# EAGLE design carteUC_V3 (EAGLE 7.5.0)
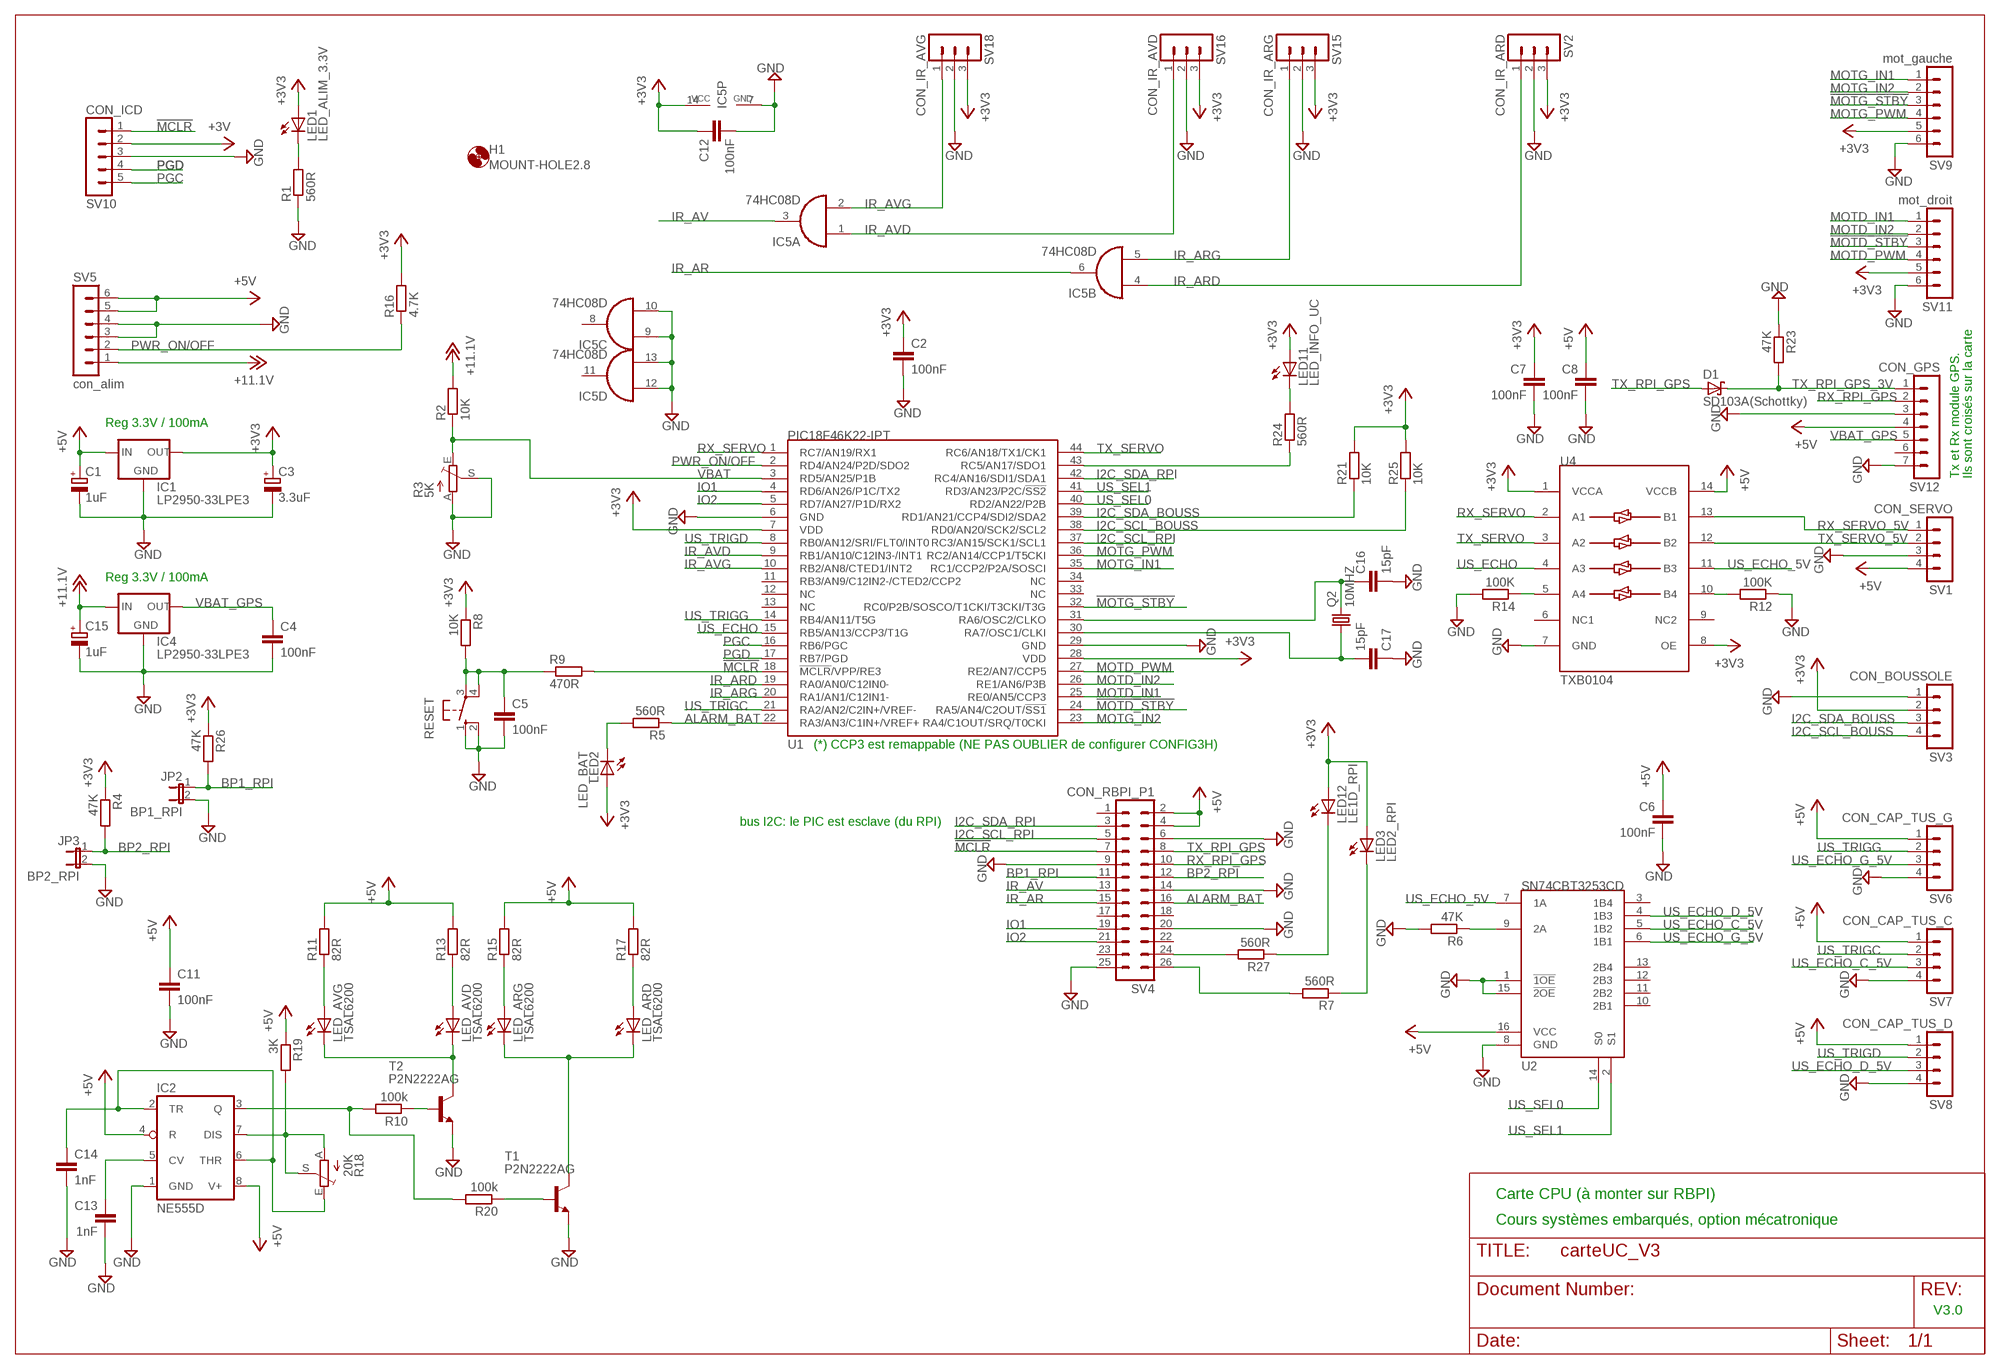
[diagram p0: schematic, sheet 1]

## Parts
C1  1uF  CPOL-EUE2.5-5  [E2,5-5]
C2  100nF  C-EUC1206  [C1206]
C3  3.3uF  CPOL-EUE2.5-5  [E2,5-5]
C4  100nF  C-EUC1206  [C1206]
C5  100nF  C-EUC1206  [C1206]
C6  100nF  C-EUC1206  [C1206]
C7  100nF  C-EUC1206  [C1206]
C8  100nF  C-EUC1206  [C1206]
C11  100nF  C-EUC1206  [C1206]
C12  100nF  C-EUC1206  [C1206]
C13  1nF  C-EU025-024X044  [C025-024X044]
C14  1nF  C-EU025-024X044  [C025-024X044]
C15  1uF  CPOL-EUE2.5-5  [E2,5-5]
C16  15pF  C5/2.5  [C5B2.5]
C17  15pF  C5/2.5  [C5B2.5]
D1  SD103A(Schottky)  SCHOTTKY-DIODEDO35-7  [DO35-7]
H1  MOUNT-HOLE2.8  [2,8]
IC1  LP2950-33LPE3  78LXX  [78LXX]
IC2  NE555D  [SO08]
IC4  LP2950-33LPE3  78LXX  [78LXX]
IC5  74HC08D  [SO14]
JP2  BP1_RPI  JP1E  [JP1]
JP3  BP2_RPI  JP1E  [JP1]
LED1  LED_ALIM_3.3V  LED3MM  [LED3MM]
LED2  LED_BAT  LED3MM  [LED3MM]
LED3  LED2_RPI  LED3MM  [LED3MM]
LED11  LED_INFO_UC  LED3MM  [LED3MM]
LED12  LE1D_RPI  LED3MM  [LED3MM]
LED_ARD  TSAL6200  LED5MM  [LED5MM]
LED_ARG  TSAL6200  LED5MM  [LED5MM]
LED_AVD  TSAL6200  LED5MM  [LED5MM]
LED_AVG  TSAL6200  LED5MM  [LED5MM]
Q2  10MHZ  CRYSTALHC49U70  [HC49U70]
R1  560R  R-EU_R1206  [R1206]
R2  10K  R-EU_R1206  [R1206]
R3  5K  TRIM_EU-S63S  [S63S]
R4  47K  R-EU_R1206  [R1206]
R5  560R  R-EU_R1206  [R1206]
R6  47K  R-EU_R1206  [R1206]
R7  560R  R-EU_R1206  [R1206]
R8  10K  R-EU_R1206  [R1206]
R9  470R  R-EU_R1206  [R1206]
R10  100k  R-EU_0207/10  [0207/10]
R11  82R  R-EU_0207/10  [0207/10]
R12  100K  R-EU_R1206  [R1206]
R13  82R  R-EU_0207/10  [0207/10]
R14  100K  R-EU_R1206  [R1206]
R15  82R  R-EU_0207/10  [0207/10]
R16  4.7K  R-EU_R1206  [R1206]
R17  82R  R-EU_0207/10  [0207/10]
R18  20K  TRIM_EU-S63P  [S63P]
R19  3K  R-EU_0207/10  [0207/10]
R20  100k  R-EU_0207/10  [0207/10]
R21  10K  R-EU_R1206  [R1206]
R23  47K  R-EU_R1206  [R1206]
R24  560R  R-EU_R1206  [R1206]
R25  10K  R-EU_R1206  [R1206]
R26  47K  R-EU_R1206  [R1206]
R27  560R  R-EU_R1206  [R1206]
RESET  10-XX  [B3F-10XX]
SV1  CON_SERVO  MA04-1  [MA04-1]
SV2  CON_IR_ARD  MA03-1  [MA03-1]
SV3  CON_BOUSSOLE  MA04-1  [MA04-1]
SV4  CON_RBPI_P1  MA13-2  [MA13-2]
SV5  con_alim  MA06-1  [MA06-1]
SV6  CON_CAP_TUS_G  MA04-1  [MA04-1]
SV7  CON_CAP_TUS_C  MA04-1  [MA04-1]
SV8  CON_CAP_TUS_D  MA04-1  [MA04-1]
SV9  mot_gauche  MA06-1  [MA06-1]
SV10  CON_ICD  MA05-1  [MA05-1]
SV11  mot_droit  MA06-1  [MA06-1]
SV12  CON_GPS  MA07-1  [MA07-1]
SV15  CON_IR_ARG  MA03-1  [MA03-1]
SV16  CON_IR_AVD  MA03-1  [MA03-1]
SV18  CON_IR_AVG  MA03-1  [MA03-1]
T1  P2N2222AG  2N2222-NPN-TO92-EBC  [TO92-EBC]
T2  P2N2222AG  2N2222-NPN-TO92-EBC  [TO92-EBC]
U1  PIC18F46K22-IPT  [TQFP44]
U2  SN74CBT3253CD  [SOIC16]
U4  TXB0104  [PSOP14]

## Nets
!MCLR!: R9.2 SV4.7 SV10.1 U1.18(!MCLR!/VPP/RE3)
!MOTD_STBY!: SV11.3 U1.24(RA5/AN4/C2OUT/!SS1)
!MOTG_STBY!: SV9.3 U1.32(RC0/P2B/SOSCO/T1CKI/T3CKI/T3G)
+3V3: C2.1 C3.+ C7.1 C12.1 IC1.OUT IC5.14(P:VCC) LED1.A LED2.A LED3.A LED11.A LED12.A R4.1 R8.1 R16.2 R21.2 R25.2 R26.1 SV2.3 SV3.2 SV9.5 SV10.2 SV11.5 SV15.3 SV16.3 SV18.3 U1.7(VDD) U1.28(VDD) U4.1(VCCA) U4.8(OE) ; supply symbol labelled +3V
+5V: C1.+ C6.1 C8.1 C11.1 IC1.IN IC2.4(R) IC2.8(V+) R11.2 R13.2 R15.2 R17.2 R19.1 SV1.4 SV4.2 SV4.4 SV5.5 SV5.6 SV6.1 SV7.1 SV8.1 SV12.4 U2.16(VCC) U4.14(VCCB)
+12V: C15.+ IC4.IN R2.2 SV5.1 ; supply symbol labelled +11.1V
ALARM_BAT: R5.1 SV4.16 U1.22(RA3/AN3/C1IN+/VREF+)
BP1_RPI: JP2.1 R26.2 SV4.11
BP2_RPI: JP3.1 R4.2 SV4.12
GND: C1.- C2.2 C3.- C4.2 C5.2 C6.2 C7.2 C8.2 C11.2 C12.2 C13.2 C14.2 C15.- C16.2 C17.1 IC1.GND IC2.1(GND) IC4.GND IC5.7(P:GND) IC5.9(C:I0) IC5.10(C:I1) IC5.12(D:I0) IC5.13(D:I1) JP2.2 JP3.2 R1.1 R3.A R3.S R6.2 R12.1 R14.2 R23.1 RESET.1(S) RESET.2(S1) SV1.3 SV2.2 SV3.1 SV4.6 SV4.9 SV4.14 SV4.20 SV4.25 SV5.3 SV5.4 SV6.4 SV7.4 SV8.4 SV9.6 SV10.3 SV11.6 SV12.3 SV12.7 SV15.2 SV16.2 SV18.2 T1.C(E) T2.C(E) U1.6(GND) U1.29(GND) U2.1(!1OE) U2.8(GND) U2.15(!2OE) U4.7(GND)
I2C_SCL_BOUSS: R25.1 SV3.4 U1.38(RD0/AN20/SCK2/SCL2)
I2C_SCL_RPI: SV4.5 U1.37(RC3/AN15/SCK1/SCL1)
I2C_SDA_BOUSS: R21.1 SV3.3 U1.39(RD1/AN21/CCP4/SDI2/SDA2)
I2C_SDA_RPI: SV4.3 U1.42(RC4/AN16/SDI1/SDA1)
IO1: SV4.19 U1.4(RD6/AN26/P1C/TX2)
IO2: SV4.21 U1.5(RD7/AN27/P1D/RX2)
IR_AR: IC5.6(B:O) SV4.15
IR_ARD: IC5.4(B:I0) SV2.1 U1.19(RA0/AN0/C12IN0-)
IR_ARG: IC5.5(B:I1) SV15.1 U1.20(RA1/AN1/C12IN1-)
IR_AV: IC5.3(A:O) SV4.13
IR_AVD: IC5.1(A:I0) SV16.1 U1.9(RB1/AN10/C12IN3-/INT1)
IR_AVG: IC5.2(A:I1) SV18.1 U1.10(RB2/AN8/CTED1/INT2)
MOTD_IN1: SV11.1 U1.25(RE0/AN5/CCP3)
MOTD_IN2: SV11.2 U1.26(RE1/AN6/P3B)
MOTD_PWM: SV11.4 U1.27(RE2/AN7/CCP5)
MOTG_IN1: SV9.1 U1.35(RC1/CCP2/P2A/SOSCI)
MOTG_IN2: SV9.2 U1.23(RA4/C1OUT/SRQ/T0CKI)
MOTG_PWM: SV9.4 U1.36(RC2/AN14/CCP1/T5CKI)
N$1: LED1.K(C) R1.2
N$2: R24.1 U1.43(RC5/AN17/SDO1)
N$3: LED2.K(C) R5.2
N$4: LED11.K(C) R24.2
N$5: C5.1 R8.2 R9.1 RESET.3(P) RESET.4(P1)
N$6: LED3.K(C) R7.1
N$7: R10.1 T2.B
N$8: LED_AVG.A R11.1
N$10: LED_AVD.A R13.1
N$11: LED_AVD.K(C) LED_AVG.K(C) T2.E(C)
N$12: R20.1 T1.B
N$13: C13.1 IC2.5(CV)
N$14: LED_ARG.A R15.1
N$15: R14.1 U4.5(A4)
N$16: LED_ARD.A R17.1
N$17: LED_ARD.K(C) LED_ARG.K(C) T1.E(C)
N$18: IC2.7(DIS) R18.A R18.S R19.2
N$19: IC2.3(Q) R10.2 R20.2
N$20: LED12.K(C) R27.1
N$21: C14.1 IC2.2(TR) IC2.6(THR) R18.E
N$22: R7.2 SV4.26
N$23: R12.2 U4.10(B4)
N$26: R6.1 U2.9(2A)
N$28: C16.1 Q2.2 U1.31(RA6/OSC2/CLKO)
N$29: C17.2 Q2.1 U1.30(RA7/OSC1/CLKI)
PGC: SV10.5 U1.16(RB6/PGC)
PGD: SV10.4 U1.17(RB7/PGD)
PWR_ON/OFF: R16.1 SV5.2 U1.2(RD4/AN24/P2D/SDO2)
RPI_LED: R27.2 SV4.24
RX_RPI_GPS: SV4.10 SV12.2
RX_SERVO: U1.1(RC7/AN19/RX1) U4.2(A1)
RX_SERVO_5V: SV1.1 U4.13(B1)
TX_RPI_GPS: D1.A SV4.8
TX_RPI_GPS_3V: D1.C R23.2 SV12.1
TX_SERVO: U1.44(RC6/AN18/TX1/CK1) U4.3(A2)
TX_SERVO_5V: SV1.2 U4.12(B2)
US_ECHO: U1.15(RB5/AN13/CCP3/T1G) U4.4(A3)
US_ECHO_5V: U2.7(1A) U4.11(B3)
US_ECHO_C_5V: SV7.3 U2.5(1B2)
US_ECHO_D_5V: SV8.3 U2.4(1B3)
US_ECHO_G_5V: SV6.3 U2.6(1B1)
US_SEL0: U1.40(RD2/AN22/P2B) U2.14(S0)
US_SEL1: U1.41(RD3/AN23/P2C/!SS2) U2.2(S1)
US_TRIGC: SV7.2 U1.21(RA2/AN2/C2IN+/VREF-)
US_TRIGD: SV8.2 U1.8(RB0/AN12/SRI/FLT0/INT0)
US_TRIGG: SV6.2 U1.14(RB4/AN11/T5G)
VBAT: R2.1 R3.E U1.3(RD5/AN25/P1B)
VBAT_GPS: C4.1 IC4.OUT SV12.5
Unconnected: IC5.8(C:O) IC5.11(D:O) SV4.1 SV4.17 SV4.18 SV4.22 SV4.23 SV12.6 U1.11(RB3/AN9/C12IN2-/CTED2/CCP2) U1.12(NC) U1.13(NC) U1.33(NC) U1.34(NC) U2.3(1B4) U2.10(2B1) U2.11(2B2) U2.12(2B3) U2.13(2B4) U4.6(NC1) U4.9(NC2)

## Notes on the sheet
- Reg 3.3V / 100mA
- Tx et Rx module GPS. | Ils sont croisés sur la carte
- Reg 3.3V / 100mA
- (*) CCP3 est remappable (NE PAS OUBLIER de configurer CONFIG3H)
- bus I2C: le PIC est esclave (du RPI)
- Carte CPU (à monter sur RBPI)
- Cours systèmes embarqués, option mécatronique
- V3.0

## Library data of the parts
C1 C3 C15 = rcl:CPOL-EU: POLARIZED CAPACITOR, European symbol
C2 C4-C8 C11-C14 = rcl:C-EU: CAPACITOR, European symbol
C16 C17 = capacitor-wima:C: CAPACITOR naming: grid - package width
D1 = diode:SCHOTTKY-DIODE: Schottky Diode
H1 = holes:MOUNT-HOLE: MOUNTING HOLE with drill center marker
IC1 IC4 = v-reg:78LXX: VOLTAGE REGULATOR
IC2 = linear:*555: TIMER
IC5 = 74xx-eu:74*08: Quad 2-input AND gate
JP2 JP3 = jumper:JP1E: JUMPER
LED1-LED3 LED11 LED12 LED_ARD LED_ARG LED_AVD LED_AVG = led:LED: LED OSRAM: - CHIPLED LG R971, LG N971, LY N971, LG Q971, LY Q971, LO R971, LY R971 LH N974, LH R974 LS Q976, LO Q976, LY Q976 LO Q996 - Hyper CHIPLED LW Q18S LB Q993, LB Q99A, LB R99A - SideLED LS A670, LO A670, LY A670, LG A670, LP A670 LB A673, LV A673, LT A673, LW A673 LH A674 LY A675 LS A676, LA A676, LO A676, LY A676, LW A676 LS A679, LY A679, LG A679 - Hyper Micro SIDELED® LS Y876, LA Y876, LO Y876, LY Y876 LT Y87S - SmartLED LW L88C, LW L88S LB L89C, LB L89S, LG L890 LS L89K, LO L89K, LY L89K LS L896, LA L896, LO L896, LY L896 - TOPLED LS T670, LO T670, LY T670, LG T670, LP T670 LSG T670, LSP T670, LSY T670, LOP T670, LYG T670 LG T671, LOG T671, LSG T671 LB T673, LV T673, LT T673, LW T673 LH T674 LS T676, LA T676, LO T676, LY T676, LB T676, LH T676, LSB T676, LW T676 LB T67C, LV T67C, LT T67C, LS T67K, LO T67K, LY T67K, LW E67C LS E67B, LA E67B, LO E67B, LY E67B, LB E67C, LV E67C, LT E67C LW T67C LS T679, LY T679, LG T679 LS T770, LO T770, LY T770, LG T770, LP T770 LB T773, LV T773, LT T773, LW T773 LH T774 LS E675, LA E675, LY E675, LS T675 LS T776, LA T776, LO T776, LY T776, LB T776 LHGB T686 LT T68C, LB T68C - Hyper Mini TOPLED® LB M676 - Mini TOPLED Santana® LG M470 LS M47K, LO M47K, LY M47K Source: http://www.osram.convergy.de LUXEON: - LUMILED® LXK2-PW12-R00, LXK2-PW12-S00, LXK2-PW14-U00, LXK2-PW14-V00 LXK2-PM12-R00, LXK2-PM12-S00, LXK2-PM14-U00 LXK2-PE12-Q00, LXK2-PE12-R00, LXK2-PE12-S00, LXK2-PE14-T00, LXK2-PE14-U00 LXK2-PB12-K00, LXK2-PB12-L00, LXK2-PB12-M00, LXK2-PB14-N00, LXK2-PB14-P00, LXK2-PB14-Q00 LXK2-PR12-L00, LXK2-PR12-M00, LXK2-PR14-Q00, LXK2-PR14-R00 LXK2-PD12-Q00, LXK2-PD12-R00, LXK2-PD12-S00 LXK2-PH12-R00, LXK2-PH12-S00 LXK2-PL12-P00, LXK2-PL12-Q00, LXK2-PL12-R00 Source: www.luxeon.com KINGBRIGHT: KA-3528ASYC Source: www.kingbright.com
Q2 = crystal:CRYSTAL: CRYSTAL; OC_FARNELL: unknown; OC_NEWARK: unknown
R1 R2 R4-R17 R19-R21 R23-R27 = resistor:R-EU_: RESISTOR, European symbol
R3 R18 = pot:TRIM_EU-: POTENTIOMETER
RESET = switch-omron:10-XX: OMRON SWITCH; MPN: B3F-1000; OC_FARNELL: 176432; OC_NEWARK: 36M3542
SV1 SV3 SV6-SV8 = con-lstb:MA04-1: PIN HEADER; OC_FARNELL: unknown; OC_NEWARK: unknown
SV2 SV15 SV16 SV18 = con-lstb:MA03-1: PIN HEADER; OC_FARNELL: unknown; OC_NEWARK: unknown
SV4 = con-lstb:MA13-2: PIN HEADER; OC_FARNELL: unknown; OC_NEWARK: unknown
SV5 SV9 SV11 = con-lstb:MA06-1: PIN HEADER; OC_FARNELL: unknown; OC_NEWARK: unknown
SV10 = con-lstb:MA05-1: PIN HEADER; OC_FARNELL: unknown; OC_NEWARK: unknown
SV12 = con-lstb:MA07-1: PIN HEADER; OC_FARNELL: unknown; OC_NEWARK: unknown
T1 T2 = transistor-neu-to92:*-NPN-: NPN Transistror
U1 = EMA_Microchip:PIC18F46K22-IPT: Microcontroleur 8bits. 44 broches. Boitier TQFP44. Tension Alim.: de 2.3V à 5.5V.
U2 = EMA_MuxDmux:SN74CBT3253CD: MUX/DEMUX 2x(4 vers 1). 5V. Fab: Texas Instrument
U4 = EMA_TI:TXB0104: Translateur de tension bidirectionnel ~3V -- ~5V Fab. Texas instrument Boitier Plastic small-outline package (PSOP)

## Board
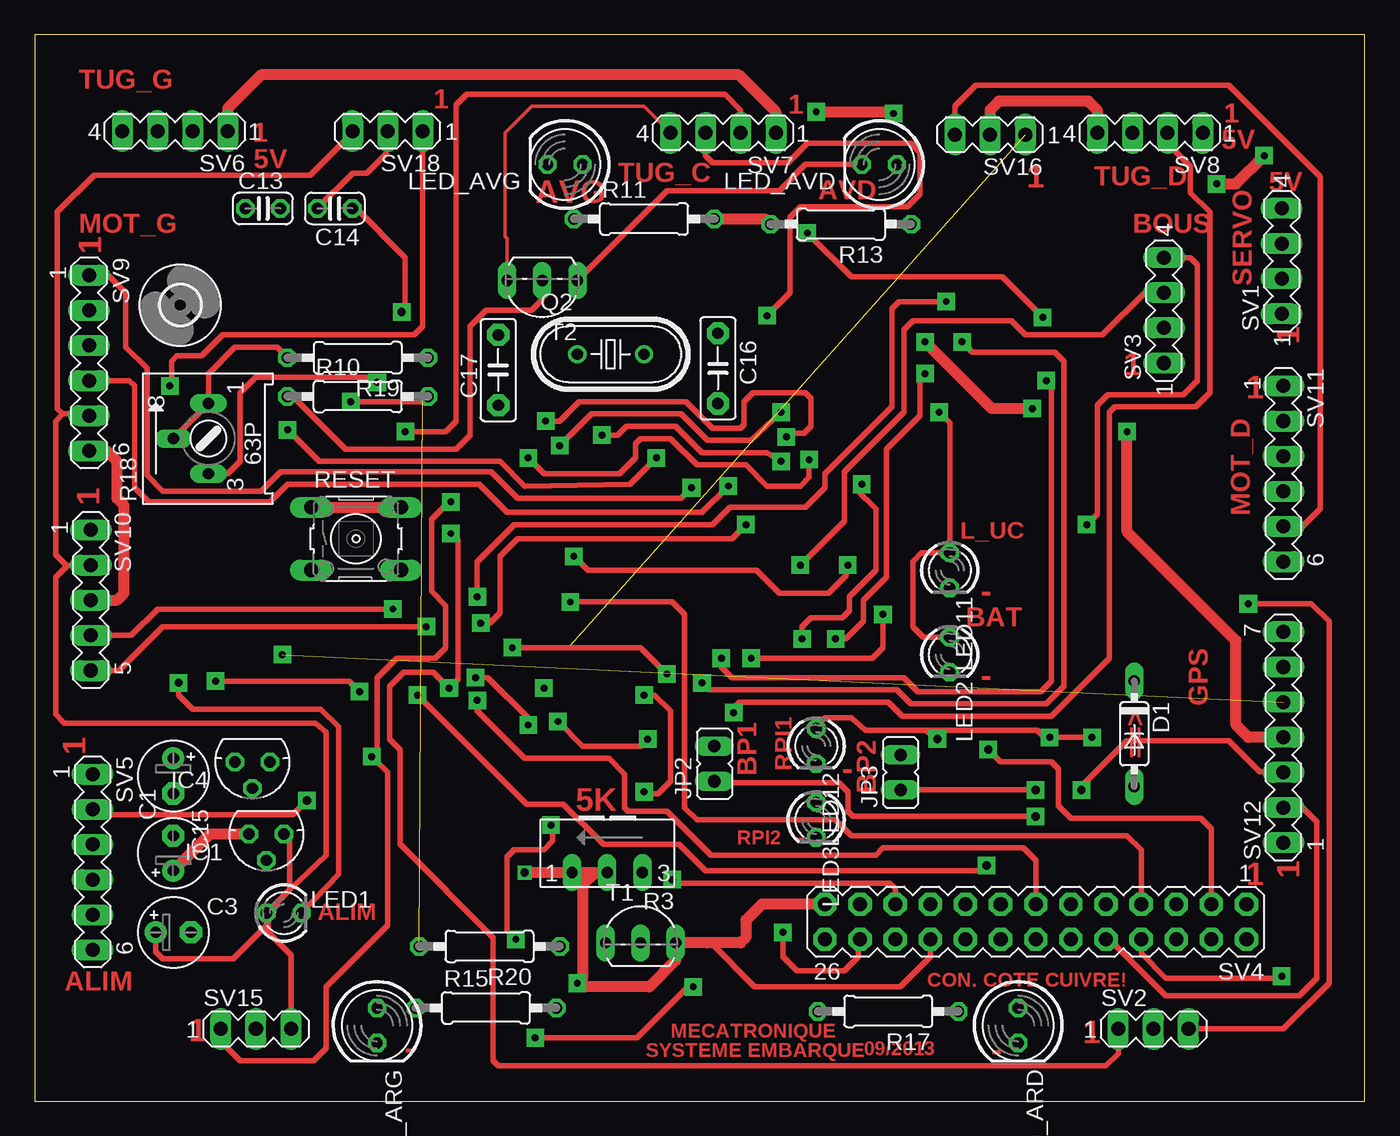
[diagram p1: board, top side]
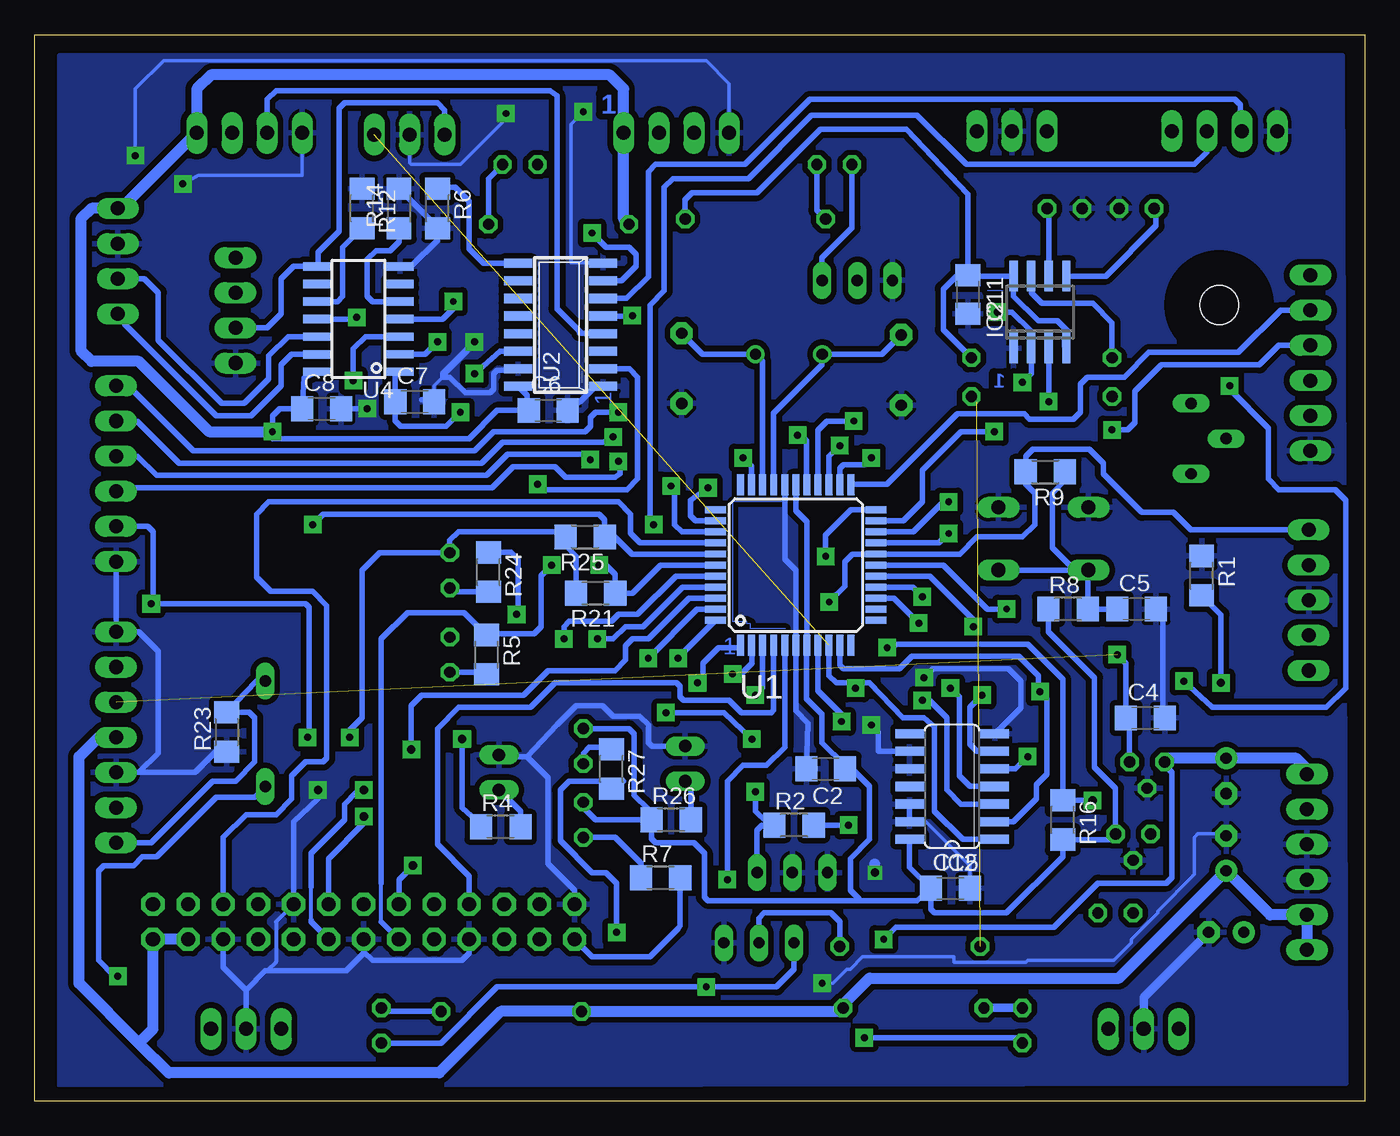
[diagram p2: board, bottom side, seen from below]

Size 96.19 x 77.08 mm. Coordinates in mm from the lower left corner, seen from the top.
Outline: 0,0 96.19,0 96.19,77.08 0,77.08 0,0
Copper layers (1*16): Top 0.035mm / dielectric 1.5mm / Bottom 0.035mm
Design rules "default": minimum track width 10mil, minimum drill 24mil, track to track 8mil, track to pad 8mil, pad to pad 8mil, via to via 8mil, smd to smd 8mil, copper to edge 40mil, drill to drill 8mil, minimum pad ring 10mil, minimum via ring 8mil, stop-mask expansion 4mil, vias tented up to drill 0mil, thermal gap 10mil

### Footprints (pad centres in the part's own frame; a part is rotated, then mirrored left to right if it is on the bottom)
E2,5-5 = drill 0.813 pad 1.6: + -1.27,0 | drill 0.813 pad 1.6 octagon: - 1.27,0
C1206 = smd 1.6 x 1.8: 1 -1.4,0; 2 1.4,0
C025-024X044 = drill 0.813 octagon: 1 -1.27,0; 2 1.27,0
C5B2.5 = drill 0.813 pad 1.6 octagon: 1 -2.54,0; 2 2.54,0
DO35-7 = drill 0.813 long: A 3.81,0; C -3.81,0
2,8 = hole 2.8: 0,0
78LXX = drill 0.813 octagon: GND 0,1.905; IN 1.27,0; OUT -1.27,0
SO08 = smd 0.6 x 2.2: 1 -1.905,-2.6; 2 -0.635,-2.6; 3 0.635,-2.6; 4 1.905,-2.6; 5 1.905,2.6; 6 0.635,2.6; 7 -0.635,2.6; 8 -1.905,2.6
SO14 = smd 0.66 x 2.032: 1 -3.81,-3.073; 2 -2.54,-3.073; 3 -1.27,-3.073; 4 0,-3.073; 5 1.27,-3.073; 6 2.54,-3.073; 7 3.81,-3.073; 8 3.81,3.073; 9 2.54,3.073; 10 1.27,3.073; 11 0,3.073; 12 -1.27,3.073; 13 -2.54,3.073; 14 -3.81,3.073
JP1 = drill 0.914 long: 1 0,-1.27; 2 0,1.27
LED3MM = drill 0.813 octagon: A -1.27,0; K 1.27,0
LED5MM = drill 0.813 octagon: A -1.27,0; K 1.27,0
HC49U70 = drill 0.813: 1 -2.413,0; 2 2.413,0
R1206 = smd 1.6 x 1.803: 1 -1.422,0; 2 1.422,0
S63S = drill 0.813 long: A 2.54,1.27; E -2.54,1.27; S 0,1.27
0207/10 = drill 0.813 octagon: 1 -5.08,0; 2 5.08,0
S63P = drill 0.813 long: A 2.54,0; E -2.54,0; S 0,2.54
B3F-10XX = drill 1.016 long: 1 -3.251,2.261; 2 3.251,2.261; 3 -3.251,-2.261; 4 3.251,-2.261
MA04-1 = drill 1.016 long: 1 -3.81,0; 2 -1.27,0; 3 1.27,0; 4 3.81,0
MA03-1 = drill 1.016 long: 1 -2.54,0; 2 0,0; 3 2.54,0
MA13-2 = drill 1.016 pad 1.676 octagon: 1 -15.24,-1.27; 2 -15.24,1.27; 3 -12.7,-1.27; 4 -12.7,1.27; 5 -10.16,-1.27; 6 -10.16,1.27; 7 -7.62,-1.27; 8 -7.62,1.27; 9 -5.08,-1.27; 10 -5.08,1.27; 11 -2.54,-1.27; 12 -2.54,1.27; 13 0,-1.27; 14 0,1.27; 15 2.54,-1.27; 16 2.54,1.27; 17 5.08,-1.27; 18 5.08,1.27; 19 7.62,-1.27; 20 7.62,1.27; 21 10.16,-1.27; 22 10.16,1.27; 23 12.7,-1.27; 24 12.7,1.27; 25 15.24,-1.27; 26 15.24,1.27
MA06-1 = drill 1.016 long: 1 -6.35,0; 2 -3.81,0; 3 -1.27,0; 4 1.27,0; 5 3.81,0; 6 6.35,0
MA05-1 = drill 1.016 long: 1 -5.08,0; 2 -2.54,0; 3 0,0; 4 2.54,0; 5 5.08,0
MA07-1 = drill 1.016 long: 1 -7.62,0; 2 -5.08,0; 3 -2.54,0; 4 0,0; 5 2.54,0; 6 5.08,0; 7 7.62,0
TO92-EBC = drill 0.813 long: B 0,-1.27; C 2.54,-1.27; E -2.54,-1.27
TQFP44 = smd 0.5 x 1.5: 1 -0.19,-3.26; 2 0.61,-3.26; 3 1.41,-3.26; 4 2.21,-3.26; 5 3.01,-3.26; 6 3.81,-3.26; 7 4.61,-3.26; 8 5.41,-3.26; 9 6.21,-3.26; 10 7.01,-3.26; 11 7.81,-3.26; 23 7.81,8.34; 24 7.01,8.34; 25 6.21,8.34; 26 5.41,8.34; 27 4.61,8.34; 28 3.81,8.34; 29 3.01,8.34; 30 2.21,8.34; 31 1.41,8.34; 32 0.61,8.34; 33 -0.19,8.34 | smd 1.5 x 0.5: 12 9.61,-1.46; 13 9.61,-0.66; 14 9.61,0.14; 15 9.61,0.94; 16 9.61,1.74; 17 9.61,2.54; 18 9.61,3.34; 19 9.61,4.14; 20 9.61,4.94; 21 9.61,5.74; 22 9.61,6.54; 34 -1.99,6.54; 35 -1.99,5.74; 36 -1.99,4.94; 37 -1.99,4.14; 38 -1.99,3.34; 39 -1.99,2.54; 40 -1.99,1.74; 41 -1.99,0.94; 42 -1.99,0.14; 43 -1.99,-0.66; 44 -1.99,-1.46
SOIC16 = smd 0.66 x 2.032: 1 0.475,-4.733; 2 1.745,-4.733; 3 3.015,-4.733; 4 4.285,-4.733; 5 5.555,-4.733; 6 6.825,-4.733; 7 8.095,-4.733; 8 9.365,-4.733; 9 9.365,1.413; 10 8.095,1.413; 11 6.825,1.413; 12 5.555,1.413; 13 4.285,1.413; 14 3.015,1.413; 15 1.745,1.413; 16 0.475,1.413
PSOP14 = smd 0.6 x 2: 1 -3.81,-3; 2 -2.54,-3; 3 -1.27,-3; 4 0,-3; 5 1.27,-3; 6 2.54,-3; 7 3.81,-3; 8 3.81,3; 9 2.54,3; 10 1.27,3; 11 0,3; 12 -1.27,3; 13 -2.55,3; 14 -3.81,3

### Placement (x,y rotation side)
C1  10.03,17.91 90 top
C2  38.99,24 180 bottom
C3  10.03,12.19 0 top
C4  15.88,27.69 0 bottom
C5  16.51,35.56 0 bottom
C6  59.05,49.91 0 bottom
C7  68.71,50.55 0 bottom
C8  75.44,50.04 0 bottom
C11  28.7,58.29 270 bottom
C12  29.97,15.37 0 bottom
C13  16.51,64.52 0 top
C14  21.72,64.52 180 top
C15  10.03,23.5 270 top
C16  49.4,52.96 270 top
C17  33.53,52.83 90 top
D1  79.5,26.54 270 top
H1  10.54,57.53 0 top
IC1  16.76,19.3 180 top
IC2  23.5,57.02 0 bottom
IC4  15.75,24.51 180 top
IC5  29.84,22.73 90 bottom
JP2  49.15,24.38 0 top
JP3  62.61,23.75 0 top
LED1  18.03,13.59 0 top
LED2  66.17,32.26 270 top
LED3  56.52,20.32 270 top
LED11  66.17,38.35 270 top
LED12  56.52,25.65 270 top
LED_ARD  71.12,5.46 270 top
LED_ARG  24.77,5.46 270 top
LED_AVD  61.09,67.69 180 top
LED_AVG  38.35,67.69 180 top
Q2  41.66,53.97 0 top
R1  11.81,37.97 270 bottom
R2  41.27,19.94 0 bottom
R3  41.4,17.78 180 top
R4  62.48,19.81 0 bottom
R5  63.5,32.26 270 bottom
R6  67.06,64.52 270 bottom
R7  50.93,16.13 0 bottom
R8  21.46,35.56 0 bottom
R9  23.11,45.47 180 bottom
R10  23.37,50.93 0 top
R11  44.07,63.75 0 top
R12  72.52,64.52 270 bottom
R13  58.29,63.37 180 top
R14  69.85,64.52 90 bottom
R15  32.64,6.73 0 top
R16  21.84,20.32 270 bottom
R17  61.72,6.48 180 top
R18  12.57,47.88 90 top
R19  23.37,53.72 180 top
R20  32.89,11.18 180 top
R21  55.63,36.7 180 bottom
R23  82.3,26.67 90 bottom
R24  63.37,38.23 270 bottom
R25  56.39,40.77 180 bottom
R26  50.16,20.32 0 bottom
R27  54.48,24 270 bottom
RESET  23.24,40.64 0 top
SV1  90.17,60.71 90 top
SV2  80.9,5.21 0 top
SV3  81.66,57.15 90 top
SV4  72.39,12.95 180 top
SV5  4.19,17.27 270 top
SV6  10.16,70.1 180 top
SV7  49.78,69.98 180 top
SV8  80.64,69.98 180 top
SV9  3.94,53.34 270 top
SV10  4.06,36.2 270 top
SV11  90.3,45.34 270 top
SV12  90.3,26.29 90 top
SV15  16,5.21 0 top
SV16  69.09,69.85 180 top
SV18  25.53,70.1 180 top
T1  43.81,12.7 0 top
T2  36.7,58.04 180 top
U1  44.96,36.2 0 bottom
U2  59.82,51.18 90 bottom
U4  72.77,56.52 90 bottom

### Tracks (layer width: path | path; a pad name or v marks a point on that pad's centre or on a via)
!MCLR!  (via drill 0.5 pad 1.27)
  Top 0.406: SV4.7 80.01,18.16 78.99,19.18 59.05,19.18 57.91,20.32 47.88,20.32 46.99,21.21 46.99,35.18 46.1,36.07 v38.73,36.07
  Bottom 0.406: SV10.1 12.57,41.27 13.84,42.54 16.13,42.54 18.92,45.34 18.92,46.1 19.94,47.12 24,47.12 24.51,46.61 24.51,45.49 R9.2 24.54,44.6 23.88,43.94 23.88,41.66 24.77,40.77 28.07,40.77 29.3,39.53 U1.18 37.05,39.53 37.59,38.99 37.59,37.21 v38.73,36.07
!MOTD_STBY!  (via drill 0.5 pad 1.27)
  Top 0.406: v35.69,46.48 36.83,45.34 42.29,45.34 43.43,46.48 43.43,47.5 43.81,47.88 45.97,47.88 47.88,45.97 51.44,45.97 52.96,44.45 55.37,44.45 56.01,45.09 v56.01,46.35
  Bottom 0.406: SV11.3 88.77,46.61 87.38,45.21 63.5,45.21 61.98,46.74 56.39,46.74 v56.01,46.35 | U1.24 37.97,44.56 37.97,45.72 37.72,45.97 36.2,45.97 v35.69,46.48
!MOTG_STBY!  (via drill 0.5 pad 1.27)
  Top 0.406: v44.96,46.48 43.05,44.58 35.43,44.45 33.66,46.23 20.57,46.23 v18.29,48.51
  Bottom 0.406: U1.32 44.35,45.87 v44.96,46.48 | SV9.3 6.22,54.61 7.62,53.21 14.73,53.21 16.64,51.31 16.64,49.02 17.14,48.51 v18.29,48.51
+3V3  (via drill 0.5 pad 1.27, 0.6)
  Top 0.406: SV15.3 18.54,10.54 16.89,12.19 16.89,13.46 LED1.A | SV2.3 90.3,5.21 93.6,8.51 93.6,34.67 92.33,35.94 v87.76,35.94 | v76.45,26.29 v73.41,26.29 73.02,26.29 72.52,26.8 64.39,26.8 | 64.39,26.8 60.07,26.8 59.05,27.69 57.15,27.69 56.52,27.05 LED12.A | v65.28,26.16 64.39,26.8 | SV16.3 66.55,71.88 68.07,73.41 86.36,73.41 92.96,66.8 92.96,42.8 91.69,41.53 SV11.5 | v65.4,49.78 66.17,49.02 LED11.A 64.13,39.62 63.5,38.99 63.5,34.29 64.26,33.53 LED2.A | LED1.A 16.76,12.7 14.35,10.29 9.27,10.29 8.76,10.79 C3.+ | LED1.A 18.44,15.26 | 18.44,15.26 18.44,18.9 IC1.OUT | 18.44,15.26 21.08,17.78 21.08,26.67 20.32,27.3 2.16,27.3 1.52,27.94 1.52,37.85 2.41,38.73 SV10.2 2.29,38.73 1.52,39.5 1.52,49.15 2.03,49.66 | SV18.3 22.99,69.98 19.94,66.93 4.32,66.93 1.65,64.26 1.65,50.04 2.03,49.66 | 2.03,49.66 3.81,49.66 SV9.5
  Bottom 0.406: U1.28 41.15,42.67 40.35,41.87 U1.7 40.39,32.9 40.39,29.08 39.24,27.94 39.24,25.91 37.59,24.25 C2.1 37.08,24 35.81,22.73 35.81,18.92 37.21,17.53 37.21,15.24 36.58,14.61 36.58,14.48 | R26.1 55.63,20.32 56.52,21.21 LED3.A | v73.41,26.29 73.41,26.8 72.52,27.69 72.52,38.35 71.25,39.62 LED11.A 66.17,40.51 65.53,41.15 58.19,41.15 R25.2 57.81,40.16 57.02,39.37 57.02,36.73 R21.2 | v76.45,26.29 76.33,26.42 76.33,35.69 76.58,35.94 v87.76,35.94 87.63,36.07 87.63,41.15 88.01,41.53 SV11.5 | R4.1 63.91,19.96 65.28,21.21 v65.28,26.16 | R26.1 51.59,18.95 51.31,18.67 48.51,18.67 47.75,17.91 47.75,14.73 47.5,14.48 36.58,14.48 | 33.53,18.92 IC5.14 32.92,16.91 C12.1 | SV3.2 79.38,55.88 78.36,56.9 78.36,59.44 77.47,60.32 U4.8 75.69,60.4 75.69,61.34 74.17,62.86 74.17,71.76 73.79,72.14 67.06,72.14 66.55,71.63 SV16.3 | U4.1 70.11,52.37 C7.1 70.11,49.15 69.72,48.77 66.42,48.77 v65.4,49.78 | R8.1 22.89,33.93 19.56,30.61 19.56,24.13 18.03,22.61 IC1.OUT 18.44,18.9 R16.2 21.84,17.65 25.91,13.59 31.12,13.59 31.37,13.85 C12.1 | C12.1 31.5,15.37 31.62,15.11 32.38,14.48 36.58,14.48 | R26.1 51.59,20.47 | R26.1 51.82,20.55 51.82,21.08 52.83,22.1 52.83,26.54 53.21,26.92 LED12.A
+5V  (via drill 0.5 pad 1.27)
  Top 0.813: SV12.4 87.76,26.29 86.87,27.18 86.87,33.27 78.99,41.15 v78.99,48.39 | 13.84,70.23 SV6.1 13.97,71.76 16.38,74.17 50.93,74.17 53.59,71.5 SV7.1 | R11.2 52.83,63.75 R13.2 | C1.+ 12.7,19.3 IC1.IN
  Bottom 0.406: U4.14 76.71,52.27 C8.1 78.49,50.04 78.99,49.53 v78.99,48.39 78.99,47.88 64.77,47.88 62.74,49.91 C6.1 60.58,50.37 60.58,51.01 U2.16 | IC2.8 28.38,59.62 C11.1 28.7,65.53 33.15,70.23 39.37,70.23 43.94,65.66 48.64,65.66 49.15,65.15 R11.2 | 21.59,55.24 21.72,55.12 21.72,54.55 IC2.4 21.46,54.3 21.46,55.63 22.23,56.39 23.62,56.39 25.4,58.17 IC2.8 | IC2.8 29.53,59.62 30.48,58.67 30.48,55.75 R19.1
  Bottom 0.813: SV5.6 SV5.5 6.86,13.46 C1.+ 17.78,8.89 35.81,8.89 37.72,6.98 R15.2 37.97,6.48 R17.2 62.48,6.48 66.93,2.03 86.49,2.03 88.65,4.19 | SV4.4 SV4.2 87.63,5.21 88.65,4.19 | SV12.4 91.57,26.29 92.96,24.89 92.96,8.51 88.65,4.19 | v78.99,48.39 83.57,48.39 88.65,53.47 92.07,53.47 92.84,54.23 92.84,63.75 92.07,64.52 SV1.4 89.92,64.52 SV8.1 84.45,73.15 83.44,74.17 54.61,74.17 53.59,73.15 SV7.1 53.59,63.75 R13.2
+12V  (via drill 0.5 pad 1.27)
  Top 0.406: v37.34,19.94 37.47,19.81 37.47,18.8 36.83,18.16 34.67,18.16 34.16,17.65 34.16,12.32 v34.8,11.68
  Bottom 0.406: R2.2 v37.34,19.94 | v34.8,11.68 33.91,12.57 22.48,12.57 19.3,15.75 14.35,15.75 13.97,16.13 13.97,23.75 14.48,24.26 IC4.IN
  Bottom 0.61: 4.83,24.77 4.95,24.77
  Bottom 0.813: SV5.1 4.19,24 4.95,24.77 C15.+ 14.22,24.77 IC4.IN
ALARM_BAT  (via drill 0.5 pad 1.27)
  Top 0.406: v38.99,39.37 40.01,38.35 52.2,38.35 53.85,36.7 57.4,36.7 58.67,37.97 58.67,38.61 v58.8,38.73
  Bottom 0.305: 71.12,12.95 71.12,15.75
  Bottom 0.406: U1.22 37.15,42.73 38.99,40.89 v38.99,39.37 | SV4.16 71.12,12.95 | 71.12,15.75 71.12,33.4 69.21,35.31 65.13,35.31 R5.1 63.4,33.78 60.07,33.78 59.56,34.29 59.56,37.97 v58.8,38.73
BP1_RPI  (via drill 0.5 pad 1.27, 0.6)
  Top 0.406: JP2.1 49.28,22.99 58.17,22.99 58.8,22.35 58.8,20.96 59.18,20.57 v72.39,20.57
  Bottom 0.406: 49.28,23.24 JP2.1 48.74,22.71 R26.2 | SV4.11 74.93,17.53 72.39,20.07 v72.39,20.57
BP2_RPI  (via drill 0.5 pad 1.27, 0.6)
  Top 0.406: v72.39,22.48 JP3.1
  Bottom 0.305: 76.2,13.08 76.2,15.49
  Bottom 0.406: SV4.12 76.2,12.95 76.2,13.08 | R4.2 61.06,20.93 JP3.1 | 76.2,15.49 76.2,17.91 73.79,20.32 73.79,21.46 72.9,22.35 72.52,22.35 v72.39,22.48
GND  (via drill 0.5 pad 1.27, 0.6)
  Top 0.254: SV7.4 44.07,71.88 35.94,71.88 34.04,69.98 34.04,62.48 34.16,62.36 T2.C
  Top 0.406: v35.69,27.18 35.69,27.69 32.77,30.61 v31.88,30.61 | SV12.3 90.23,23.81 88.58,23.81 86.36,26.04 78.99,26.04 75.69,22.73 v75.69,22.48 | SV4.20 64.77,10.41 62.61,8.25 52.07,8.25 48.9,11.43 48.64,11.43 | C14.2 22.99,67.06 24,67.06 25.4,68.45 25.4,69.98 SV18.2
  Top 0.813: RESET.1 RESET.2 | SV4.25 52.58,14.22 51.44,13.08 51.44,11.81 51.05,11.43 48.64,11.43 T1.C 46.36,10.16 44.45,8.25 39.5,8.25 v39.24,8.51 39.62,8.89 39.62,15.62 40.51,16.51 | R3.A 38.86,16.38 | SV16.2 69.09,71.63 69.72,72.26 76.2,72.26 76.83,71.63 SV8.4 | v72.14,50.04 69.21,50.04 v64.39,54.86 | v56.52,71.5 61.98,71.5 v62.1,71.37 | v85.47,66.29 86.87,66.29 v88.9,68.33 | SV10.3 5.97,36.2 6.48,36.7 6.48,43.05 5.97,43.56 5.97,46.23 5.21,46.99 SV9.6 | R3.A v35.43,16.51 | 40.51,16.51 41.53,16.51 | 40.51,16.51 R3.A
  Bottom 0.254: 41.91,44.57 U1.29 | v39.24,8.51 38.48,8.51 37.47,9.53 37.21,9.53 36.32,10.41 29.72,10.41 29.72,10.03 24.51,10.03 24.38,10.16 18.16,10.16 16.89,11.43 16.89,11.68 14.99,13.59 14.99,13.72 12.32,16.38 12.32,19.05 12.07,19.3 10.16,19.3 C1.- | v64.39,54.86 64.9,54.1 66.67,52.32 67.31,51.69 C7.2 | U2.8 55.12,60.58 57.4,60.58 57.4,70.61 v56.52,71.5 | v62.1,71.37 62.1,70.99 65.4,67.69 68.96,67.69 69.09,67.82 SV16.2 | SV8.4 76.83,66.93 84.33,66.93 v85.47,66.29 | v88.9,68.33 88.9,73.15 86.87,75.18 47.62,75.18 45.97,73.53 SV7.4 | C12.2 28.57,17.02 31.75,20.19 IC5.13
  Bottom 0.305: SV4.9 78.74,12.95 78.74,10.03 79.38,9.4
  Bottom 0.406: U1.29 41.95,39.15 41.15,38.35 U1.6 41.15,28.19 40.26,27.31 C2.2 | 82.42,25.5 R23.1 83.08,25.25 84.58,23.75 88.65,23.75 | SV2.2 80.9,8 | 80.9,8 82.55,9.65 SV4.6 | C4.2 14.61,28.07 14.61,35.05 C5.2 | RESET.1 19,42.9 | C6.2 56.77,50.55 55.75,51.56 55.18,51.56 U2.1 | SV12.3 88.65,23.75 | 88.65,23.75 87.25,25.15 87.25,32.51 88.65,33.91 SV12.7 SV11.6 | SV4.20 64.77,10.67 65.28,10.16 71.75,10.16 72.39,10.79 SV4.14 72.39,10.67 73.66,9.4 79.38,9.4 79.5,9.4 80.9,8 | U4.7 68.96,60.32 67.06,62.23 R6.2 67.06,63.14 R14.2 | C7.2 68.2,50.68 | 33.05,20.07 IC5.13 | IC5.13 IC5.12 | IC5.13 32.79,20.07 | v35.69,27.18 35.18,26.67 35.18,25.27 IC5.9 | SV4.9 77.47,20.19 75.69,21.84 v75.69,22.48 | SV4.25 57.15,15.24 59.05,17.14 59.05,23.37 60.58,24.89 | 60.58,24.89 62.48,24.89 JP3.2 | C8.2 v72.14,50.04 | v64.39,54.86 66.67,52.58 66.67,52.32 66.17,52.32 65.02,51.18 63.25,51.18 62.99,51.43 62.99,52.58 62.74,52.83 61.21,52.83 | 60.58,24.89 58.42,27.18 57.02,28.58 55.12,28.58 54.36,27.81 52.45,27.81 51.82,27.18 51.82,25.91 51.56,25.65 JP2.2 | 26.8,26.57 IC5.7 24.89,28.42 24.89,30.35 25.78,31.24 31.24,31.24 v31.88,30.61
  Bottom 0.61: SV15.2 16,7.49 C3.-
  Bottom 0.813: v35.43,16.51 35.43,17.14
  pour Bottom (isolate 0.406): 1.65,75.57 94.36,75.57 94.36,1.14 1.4,1.27
I2C_SCL_BOUSS  (via drill 0.5 pad 1.27)
  Top 0.406: SV3.4 83.57,60.96 84.07,60.45 84.07,52.07 83.06,51.05 77.6,51.05 76.83,50.29 76.83,42.42 v76.07,41.66
  Bottom 0.406: U1.38 53,39.53 54.36,40.89 54.36,41.3 R25.1 54.97,42.01 55.37,42.42 75.31,42.42 v76.07,41.66
I2C_SCL_RPI
  Bottom 0.406: U1.37 52.4,40.34 53.09,41.02 53.09,42.42 53.98,43.31 79.25,43.31 80.14,42.42 80.14,37.85 79.12,36.83 76.07,36.83 75.06,35.81 75.06,24.77 75.31,24.51 76.58,24.51 77.6,23.5 77.6,21.84 78.74,20.7 80.9,20.7 82.55,19.05 SV4.5
I2C_SDA_BOUSS  (via drill 0.5 pad 1.27)
  Top 0.406: SV3.3 80.26,58.42 77.22,55.37 71.63,55.37 70.61,56.39 63.5,56.39 62.87,55.75 62.87,49.78 58.55,45.47 58.55,41.91 v55.37,38.73
  Bottom 0.406: U1.39 50.93,38.73 52.96,36.7 R21.1 54.2,38.07 54.86,38.73 v55.37,38.73
I2C_SDA_RPI  (via drill 0.6)
  Top 0.406: 85.09,16.13 SV4.3 85.09,19.69 84.33,20.45 74.93,20.45 74.04,21.34 74.04,24 73.53,24.51 69.85,24.51 v68.96,25.4
  Bottom 0.406: U1.42 48.88,36.34 51.82,33.4 52.96,33.4 53.47,32.89 53.47,31.88 54.23,31.12 59.05,31.12 60.83,29.34 68.2,29.34 68.96,28.58 v68.96,25.4
IO1
  Bottom 0.406: U1.4 42.75,28.25 42.93,28.07 45.09,28.07 45.97,28.96 49.28,28.96 49.53,29.21 49.53,29.97 49.78,30.23 58.55,30.23 60.33,28.45 65.53,28.45 67.06,26.92 67.06,18.54 64.77,16.26 SV4.19
IO2  (via drill 0.5 pad 1.27)
  Top 0.406: SV4.21 62.23,15.37 61.85,15.75 46.36,15.75 v46.1,16
  Bottom 0.406: U1.5 41.95,25.57 43.26,24.26 44.96,24.26 46.1,23.11 v46.1,16
IR_AR  (via drill 0.5 pad 1.27, 0.6 pad 1.27)
  Top 0.406: 68.58,17.02 v68.83,17.02 68.45,16.64 48.51,16.64 46.61,18.54 41.15,18.54 38.23,21.46 35.56,21.46 v27.69,29.34 27.56,29.34
  Bottom 0.406: IC5.6 28.07,25.27 28.57,25.78 28.57,28.45 v27.69,29.34 | SV4.15 69.85,16 v68.83,17.02
IR_ARD  (via drill 0.5 pad 1.27)
  Top 0.406: SV2.1 78.36,3.43 77.47,2.54 33.53,2.54 33.15,2.92 33.15,11.81 26.42,18.54 26.42,25.4 25.65,26.16 25.65,29.97 26.67,30.99 28.83,30.99 v29.97,29.85 30.61,30.48 30.61,40.51 v30.1,41.02
  Bottom 0.406: U1.19 30.79,40.34 v30.1,41.02 | IC5.4 28.57,22.73 29.34,23.5 29.34,29.21 v29.97,29.85
IR_ARG  (via drill 0.5 pad 1.27)
  Top 0.406: SV15.1 13.46,4.32 14.86,2.92 20.19,2.92 21.08,3.81 21.08,8.25 25.53,12.7 25.53,23.75 v24.38,24.89 24.77,25.27 24.77,30.61 26.16,32 28.96,32 29.72,32.77 29.72,35.81 28.7,36.83 28.7,42.04 29.97,43.31 v30.1,43.31
  Bottom 0.406: U1.20 32.65,41.13 30.48,43.31 v30.1,43.31 | IC5.5 25.27,24 v24.38,24.89
IR_AV  (via drill 0.5 pad 1.27)
  Top 0.406: SV4.13 72.39,17.4 71.5,18.29 61.34,18.29 60.83,17.78 48.9,17.78 45.72,20.96 42.93,20.96 42.67,21.21 42.67,23.62 41.53,24.77 35.43,24.77 32,28.19 v32,28.96
  Bottom 0.406: IC5.3 29.21,21.46 30.23,22.48 30.23,27.69 31.5,28.96 v32,28.96
IR_AVD  (via drill 0.5 pad 1.27)  (1 unrouted)
  Bottom 0.406: U1.9 38.75,30.75 38.23,30.23 37.21,30.23 v36.83,29.85 36.45,30.23 35.81,30.23 33.4,27.69 31.88,27.69 31.12,27.05 31.12,20.96 29.08,18.92 IC5.1
IR_AVG  (via drill 0.5 pad 1.27)
  Top 0.406: v13.08,30.35 22.73,30.35 v23.5,29.59 | SV18.1 28.07,56.01 27.43,55.37 13.59,55.37 12.07,53.85 10.29,53.85 9.91,53.47 9.91,51.82 v9.78,51.69
  Bottom 0.406: IC5.2 25.4,20.19 23.75,21.84 23.75,22.86 22.99,23.62 22.99,29.08 v23.5,29.59 23.62,29.72 23.62,30.73 25.02,32.13 32.77,32.13 33.66,31.24 37.72,31.24 37.97,31.5 37.97,32.91 U1.10 | v9.78,51.69 9.78,51.43 6.99,48.64 6.99,44.96 6.22,44.2 2.16,44.2 1.4,43.43 1.4,29.85 2.79,28.45 11.05,28.45 v13.08,30.35
MOTD_IN1  (via drill 0.5 pad 1.27)
  Top 0.406: v37.97,47.37 40.26,49.66 46.74,49.66 48.64,47.75 51.82,47.75 v53.98,49.78
  Bottom 0.406: U1.25 38.75,46.6 v37.97,47.37 | SV11.1 89.41,51.69 84.71,46.99 64.39,46.99 62.99,48.39 56.39,48.39 56.01,48.77 56.01,49.4 55.63,49.78 v53.98,49.78
MOTD_IN2  (via drill 0.5 pad 1.27)
  Top 0.406: v54.36,48.01 54.74,48.26 55.63,48.26 56.13,48.77 56.13,50.8 55.75,51.18 51.94,51.18 51.31,50.55 51.31,48.89 51.05,48.64 49.02,48.64 47.12,50.55 39.37,50.55 37.97,49.15 v36.96,49.15
  Bottom 0.406: SV11.2 88.77,49.15 85.72,46.1 63.88,46.1 62.36,47.62 55.12,47.62 v54.36,48.01 | U1.26 | U1.26 39.55,48.49 38.89,49.15 v36.96,49.15
MOTD_PWM  (via drill 0.5 pad 1.27)
  Top 0.406: v53.98,46.23 52.96,46.86 48.26,46.86 46.36,48.77 42.8,48.77 42.16,48.13 v41.02,48.13
  Bottom 0.406: v53.98,46.23 53.85,46.35 53.85,45.34 54.23,45.09 57.79,45.09 58.55,45.85 61.6,45.85 63.12,44.32 90.04,44.32 SV11.4 | U1.27 40.39,44.57 40.39,47.75 40.77,48.13 v41.02,48.13
MOTG_IN1  (via drill 0.5 pad 1.27)
  Top 0.406: SV9.1 5.33,59.69 6.6,58.42 6.6,54.48 8.13,52.96 8.13,45.21 9.27,44.07 16.38,44.07 17.78,45.47 33.02,45.47 34.93,43.56 46.74,43.56 v47.5,44.32
  Bottom 0.406: v47.5,44.32 48.77,43.43 48.77,42.29 48.41,41.93 U1.35
MOTG_IN2
  Bottom 0.406: SV9.2 6.1,57.15 9.14,54.1 15.62,54.1 17.4,52.32 20.07,52.32 20.57,51.82 20.57,49.78 21.08,49.28 24.26,49.28 24.64,49.66 29.46,49.66 34.54,44.58 37.11,44.58 U1.23
MOTG_PWM  (via drill 0.5 pad 1.27)
  Top 0.406: SV9.4 6.86,52.07 7.24,51.69 7.24,44.32 8.25,43.31 17.02,43.31 18.29,44.58 32.13,44.58 34.16,42.54 48.26,42.54 v50.16,44.45
  Bottom 0.406: U1.36 49.39,41.13 49.91,41.66 49.91,44.2 v50.16,44.45
N$1  (via drill 0.5 pad 1.27, 0.6 pad 0.61)
  Top 0.406: LED1.K 21.97,16.38 21.97,27.05 20.7,28.32 11.43,28.32 10.41,29.34 v10.41,30.23
  Bottom 0.406: v10.41,30.23 10.41,35.15 R1.2
N$2  (via drill 0.5 pad 1.27)
  Top 0.406: v51.82,32 60.58,32 61.34,32.77 v61.34,35.18
  Bottom 0.406: U1.43 48.29,35.53 v51.82,32 | R24.1 61.75,39.65 61.21,39.12 61.21,35.31 v61.34,35.18
N$3
  Bottom 0.406: LED2.K 63.65,30.99 R5.2
N$4
  Bottom 0.406: 66.52,37.06 LED11.K 65.89,36.8 R24.2
N$5
  Bottom 0.406: RESET.3 19.99,38.53 | R9.1 21.69,44.86 22.61,43.94 22.61,40 21.08,38.48 20.09,38.48 RESET.3 | C5.1 R8.2 20.04,38.33 RESET.3 | RESET.4 RESET.3
N$6
  Bottom 0.406: 52.96,16.64 R7.1 52.35,17.17 54.23,19.05 LED3.K
N$7
  Top 0.406: R10.1 18.67,50.93 22.48,47.12 30.48,47.12 31.5,48.13 31.5,56.01 32.64,57.15 35.94,57.15 36.7,57.91 T2.B
N$8
  Bottom 0.406: LED_AVG.A 39.62,64.39 R11.1
N$9  (via drill 0.5 pad 1.27)
  other vias: 26.54,57.02
N$10
  Bottom 0.406: R13.1 63.37,66.68 LED_AVD.A
N$11
  Top 0.406: LED_AVD.K 55.75,67.69 53.85,65.79 45.72,65.79 T2.E
  Bottom 0.406: T2.E 39.24,60.96 37.08,63.12 LED_AVG.K
N$12
  Bottom 0.406: R20.1 37.97,12.95 38.61,13.59 43.43,13.59 43.81,13.21 T1.B
N$13
  Bottom 0.406: IC2.5 18.74,59.62 15.11,63.25 15.11,64.39 C13.1
N$14
  Bottom 0.61: LED_ARG.A R15.1
N$15
  Bottom 0.406: U4.5 71.75,57.78 72.14,58.17 72.14,60.83 71.5,61.47 70.48,61.47 69.85,62.1 R14.1
N$16
  Bottom 0.406: R17.1 70.87,6.48 LED_ARD.A
N$17  (via drill 0.5 pad 1.27)
  Top 0.406: v47.62,8.25 47.24,8.25 43.56,4.57 v36.2,4.57
  Bottom 0.406: LED_ARD.K 66.8,4.19 62.74,8.25 v47.62,8.25 42.55,8.25 41.27,9.53 T1.E | v36.2,4.57 25.15,4.57 LED_ARG.K
N$18
  Top 0.406: R19.2 17.53,54.48 14.48,54.48 12.57,52.58 R18.A R18.S
  Bottom 0.406: R19.2 18.29,56.26 19.69,57.66 23.37,57.66 24.13,58.42 24.13,59.37 IC2.7
N$19  (via drill 0.5 pad 1.27)  (1 unrouted)
  Top 0.406: v22.86,50.55 28.07,50.55 R10.2
  Bottom 0.406: IC2.3 v22.86,50.55
N$20
  Bottom 0.406: R27.1 54.84,25.55 56.11,25.55 56.52,25.15 LED12.K
N$21  (via drill 0.5 pad 1.27, 0.6)
  Top 0.406: v26.54,57.02 26.8,57.15 26.8,60.96 23.24,64.52 C14.1 | v24.77,51.94 24.38,52.32 16,52.32 14.86,51.18 14.86,46.23 13.97,45.34 R18.E
  Bottom 0.406: IC2.6 22.86,64.39 C14.1 | v26.54,57.02 25.53,57.02 24.13,55.63 IC2.2 24.13,52.58 v24.77,51.94
N$22
  Bottom 0.406: R7.2 49.53,12.67 49.66,12.45 51.69,10.41 55.88,10.41 SV4.26
N$23
  Bottom 0.406: U4.10 74.29,57.78 73.91,58.17 73.91,61.7 R12.2
N$24  (via drill 0.5 pad 1.27)
  other vias: 65.28,26.16
N$25  (via drill 0.5 pad 1.27)
  other vias: 68.96,25.4
N$26
  Bottom 0.406: U2.9 63.72,60.55 64.77,61.59 64.77,65.02 65.79,66.04 66.95,66.04 R6.1
N$27
  Bottom 0: 41.78,43.31 45.72,43.31 45.72,34.67 44.7,34.67 44.7,34.54 44.45,34.54 44.45,34.16 41.91,34.16
N$28
  Bottom 0.406: U1.31 43.55,53.45 Q2.2 47.88,53.97 C16.1
N$29
  Bottom 0.406: U1.30 42.75,49.71 39.24,53.21 Q2.1 34.93,53.97 C17.2
N$30
  Bottom 0: 26.16,58.55 27.3,58.55
PGC  (via drill 0.5 pad 1.27)
  Top 0.406: SV10.5 6.1,31.12 9.27,34.29 v28.32,34.29
  Bottom 0.406: U1.16 31.46,37.93 28.32,34.8 v28.32,34.29 28.7,34.29
PGD  (via drill 0.5 pad 1.27)
  Top 0.406: SV10.4 6.99,33.66 8.89,35.56 v25.91,35.56
  Bottom 0.406: U1.17 30.48,38.73 27.3,35.56 v25.91,35.56
PWR_ON/OFF  (via drill 0.5 pad 1.27, 0.6)
  Top 0.406: v19.69,21.72 18.67,20.7 4.57,20.7 SV5.2 | v34.54,32.77 43.81,32.77 v45.72,30.86
  Bottom 0.406: U1.2 44.32,32.91 44.32,31.62 45.21,30.73 45.59,30.73 v45.72,30.86 | v19.69,21.72 19.84,21.74 R16.1 21.84,30.48 24.38,33.02 33.91,33.02 34.16,32.77 v34.54,32.77
RPI_LED  (via drill 0.5 pad 1.27)
  Top 0.406: v54.1,12.19 54.1,10.41 55.12,9.4 58.55,9.4 59.56,10.41 59.56,11.56 SV4.24
  Bottom 0.406: v54.1,12.19 54.1,15.75 54.86,16.51 55.88,16.51 58.17,18.8 58.17,22.48 57.53,23.11 53.59,23.11 53.75,23.09 R27.2
RX_RPI_GPS
  Top 0.406: SV4.10 77.72,11.68 81.79,7.62 91.44,7.62 92.71,8.89 92.71,20.19 91.69,21.21 SV12.2
RX_SERVO  (via drill 0.5 pad 1.27)
  Top 0.406: v48.26,30.23 48.77,29.72 62.36,29.72 63.37,28.7 73.15,28.7 74.42,29.97 74.42,53.47 73.79,54.1 67.82,54.1 v67.06,54.86
  Bottom 0.406: v48.26,30.23 47.86,30.23 47.86,31.64 46.74,32.77 45.32,32.77 U1.1 | U4.2 67.94,53.97 v67.06,54.86
RX_SERVO_5V
  Bottom 0.406: U4.13 77.61,53.96 78.36,53.21 78.36,51.69 80.52,49.53 83.06,49.53 89.66,56.13 89.66,56.39 SV1.1
TX_RPI_GPS  (via drill 0.5 pad 1.27)
  Top 0.406: 80.01,10.92 SV4.8 80.01,10.67 81.79,8.89 90.04,8.89 v90.17,9.02
  Bottom 0.406: D1.A 80.26,21.97 83.06,21.97 87.38,17.65 88.39,17.65 89.03,17.02 91.19,17.02 91.57,16.64 91.57,10.16 90.42,9.02 v90.17,9.02
TX_RPI_GPS_3V
  Bottom 0.406: D1.C 80.16,30.35 R23.2 80.67,28.09 80.26,27.69 80.26,24.51 81.66,23.11 83.31,23.11 87.76,18.67 SV12.1
TX_SERVO  (via drill 0.5 pad 1.27)
  Top 0.406: 49.78,31.88 v49.66,32 49.66,31.37 50.42,30.61 62.87,30.61 63.88,29.59 72.77,29.59 73.53,30.35 73.53,52.07 v73.15,52.07
  Bottom 0.406: U1.44 49.66,32.03 v49.66,32 | 73.28,52.32 v73.15,52.07 73.15,54.36 72.26,55.24 U4.3
TX_SERVO_5V
  Bottom 0.406: U4.12 77.85,55.24 79.25,53.85 79.25,52.2 81.03,50.42 82.68,50.42 87.25,54.99 87.25,58.42 88.27,59.44 SV1.2
US_ECHO  (via drill 0.5 pad 1.27)
  Top 0.406: v32,36.45 32,38.99 34.67,41.66 49.02,41.66 50.29,42.93 55.75,42.93 57.15,44.32 57.15,45.34 61.98,50.16 61.98,57.28 62.48,57.78 v65.91,57.78
  Bottom 0.406: U1.15 32.69,37.13 v32,36.45 | U4.4 66.67,56.52 65.91,57.28 v65.91,57.78
US_ECHO_5V  (via drill 0.5 pad 1.27)
  Top 0.406: v55.88,62.74 59.05,59.56 69.98,59.56 v72.9,56.64
  Bottom 0.406: U2.7 53.75,59.28 52.7,60.32 52.7,61.21 53.21,61.72 54.86,61.72 v55.88,62.74 | v72.9,56.64 73.02,56.52 U4.11
US_ECHO_C_5V  (via drill 0.5 pad 1.27)
  Top 0.406: v52.96,56.77 54.61,58.42 54.61,63.88 55.37,64.64 63.12,64.64 64.01,65.53 64.01,68.58 63.37,69.22 55.88,69.22 54.48,67.82 49.02,67.82 48.51,68.33 SV7.3
  Bottom 0.406: U2.5 52.99,56.74 v52.96,56.77
US_ECHO_D_5V
  Bottom 0.406: SV8.3 79.38,72.39 78.74,73.03 58.93,73.03 58.42,72.64 58.42,57.28 56.64,55.5 | 56.77,55.5 56.64,55.5 | 56.64,55.5 55.12,55.5 U2.4
US_ECHO_G_5V
  Bottom 0.406: U2.6 53.37,58.01 51.82,59.56 51.82,67.18 51.31,67.69 44.83,67.69 40.13,72.39 9.4,72.39 9.02,72.01 9.02,70.23 SV6.3
US_SEL0  (via drill 0.5 pad 1.27)
  Top 0.406: v57.91,33.4 58.67,33.4 59.94,34.67 59.94,36.2 61.6,37.85 61.6,47.12 64.01,49.53 64.01,52.45 v64.39,52.58
  Bottom 0.406: v57.91,33.4 57.91,34.29 57.53,34.67 54.48,34.67 53.98,35.18 52.58,35.18 49.82,37.93 U1.40 | U2.14 62.52,54.2 v64.39,52.58
US_SEL1  (via drill 0.5 pad 1.27)
  Top 0.406: v59.82,44.58 59.44,44.2 60.83,42.8 60.83,38.35 58.93,36.45 58.93,35.43 58.42,34.92 56.13,34.92 55.5,34.29 v55.5,33.4
  Bottom 0.406: U2.2 53.18,52.93 52.58,52.32 52.58,44.96 53.34,44.2 59.44,44.2 v59.82,44.58 | v55.5,33.4 54.36,33.4 53.47,34.29 52.2,34.29 49.35,37.13 U1.41
US_TRIGC  (via drill 0.5 pad 1.27)
  Top 0.406: SV7.2 51.05,71.63 49.91,72.77 31.24,72.77 30.48,72.01 30.48,49.15 29.72,48.39 v26.8,48.39
  Bottom 0.406: U1.21 33.38,41.93 32,43.31 32,45.59 29.21,48.39 v26.8,48.39
US_TRIGD  (via drill 0.5 pad 1.27)
  Top 0.406: SV8.2 81.91,69.22 83.57,67.56 83.57,65.66 84.96,64.26 84.96,51.18 83.95,50.16 78.1,50.16 77.72,49.78 77.72,32 73.53,27.81 62.74,27.81 61.72,28.83 50.93,28.83 50.55,28.45 v50.55,28.07 | v44.32,26.16 43.81,25.65 39.62,25.65 v37.85,27.43
  Bottom 0.406: v44.32,26.16 46.36,28.07 v50.55,28.07 | U1.8 39.55,29.64 37.85,27.94 v37.85,27.43
US_TRIGG  (via drill 0.5 pad 1.27)
  Top 0.406: v32.26,34.54 32.89,34.54 33.66,35.31 33.66,39.37 34.93,40.64 50.42,40.64 v51.44,41.66
  Bottom 0.406: U1.14 34.05,36.34 v32.26,34.54 | v51.44,41.66 51.69,42.16 51.69,57.53 50.67,58.55 50.67,66.04 50.04,66.68 44.58,66.68 40.01,71.25 32.38,71.25 28.83,67.69 12.32,67.69 11.43,68.58 SV6.2
VBAT  (via drill 0.5 pad 1.27)
  Top 0.406: v44.07,29.34 44.83,29.34 45.97,28.19 45.97,23.11 45.09,22.23 44.2,22.23 v44.07,22.35
  Bottom 0.406: R3.E 43.94,19.58 43.59,19.94 R2.1 42.93,20.17 43.28,20.17 44.07,20.96 v44.07,22.35 | U1.3 43.55,29.86 v44.07,29.34
VBAT_GPS  (via drill 0.5 pad 1.27)  (1 unrouted)
  Top 0.406: v17.91,32.26 17.78,32.13
  Bottom 0.406: IC4.OUT 17.02,27.43 C4.1 17.28,31.63 v17.91,32.26

### Text on the board
Top: TUG_G | 1 | 1 | 1 | 1 | 5V | 5V | 1 | 5V | TUG_C | TUG_D | AVG | AVD | MOT_G | BOUS | 1 | SERVO | 1 | 1 | 1 | 1 | MOT_D | L_UC | - | BAT | - | GPS | 1 | - | ==> | RPI1 | BP1 | BP2 | 5K | - | RPI2 | 1 | 1 | ALIM | ALIM | CON. COTE CUIVRE! | 1 | 1 | - | MECATRONIQUE | - | SYSTEME EMBARQUE | 09/2013
Bottom: 1 | 1